# Altium project PCB_Project.PrjPcb (part 2 of 2)
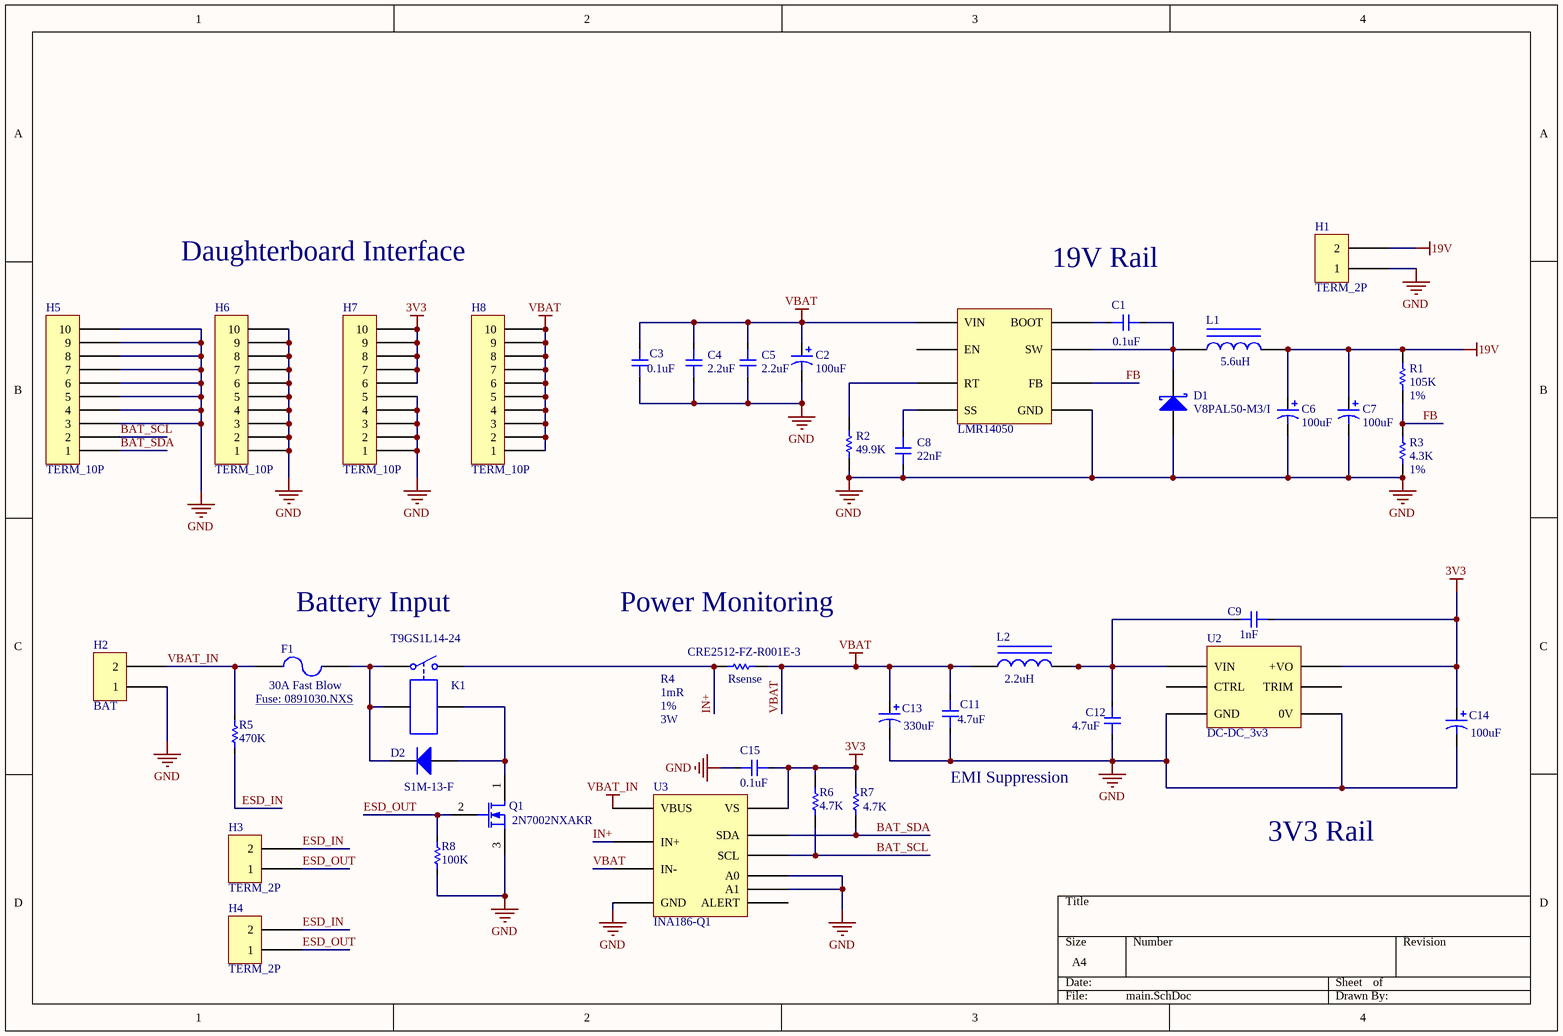
[diagram p1: main.SchDoc]

## Sheet main.SchDoc (continued)

### Library data of the parts
C1 = CAP 0805: Manufacturer: Yageo; Manufacturer Part Number: AC0805KRX7R8BB104; Voltage: 50V; Tolerance: 10%; Voltage Rating: 25V; Supplier 1: Digi-Key; Supplier Part Number 1: 311-3169-1-ND; Stock 1: 13795; Pricing 1: 1=0.23000, 10=0.15800, 100=0.08000, 500=0.05470, 1000=0.04840 (USD); RoHS: No; Mount: Surface Mount; Case/Package: 0805; Case Code (Imperial): 0805; Case Code (Metric): 2012; Min Operating Temperature: -55°C; Max Operating Temperature: 125°C; Packaging: Tape and Reel; Ratings: AEC-Q200; ComponentLink1URL: http://www.yageo.com/NewPortal/_en/search/productDocs.jsp?YageoPartNumber=AC0805KRX7R8BB104&src-supplier=Digi-Key; ComponentLink1Description: http://www.yageo.com/NewPortal/_en/search/productDocs.jsp?YageoPartNumber=AC0805KRX7R8BB104&src-supplier=Digi-Key
C2 = Cap Pol1: Polarized Capacitor (Radial); Manufacturer: Panasonic; Manufacturer Part Number: EEE-FTH101XAP; Tolerance: 20%; ESR (Equivalent Series Resistance): 340mR; Ripple Current: 350mA; Life (Hours): 2000Hour; Voltage: 50V; Leakage Current: 50uA; Lead Diameter: 0.65mm; Supplier 1: Digi-Key; Supplier Part Number 1: PCE5024CT-ND; Stock 1: 39470; Pricing 1: 1=0.76000, 10=0.56300, 100=0.38580 (USD); RoHS: Yes; Mount: Surface Mount,PCB; Case/Package: Radial; Number of Pins: 2; Contact Plating: Tin; Min Operating Temperature: -55°C; Max Operating Temperature: 105°C; Termination: SMD/SMT; Ripple Current (AC): 350mA; Packaging: Tape and Reel; Voltage Rating: 50V; Package Quantity: 1; Voltage Rating (DC): 50V; Diameter: 6.3mm; Length: 7.7mm; Height: 7.7mm; Height - Seated (Max): 0.315inch; Lead Pitch: 1.8mm; Radiation Hardening: No; REACH SVHC: No SVHC; ComponentLink1URL: https://datasheet.ciiva.com/11780/0900766b80f4973e-11780053.pdf?src-supplier=RSComponents; ComponentLink1Description: https://datasheet.ciiva.com/11780/0900766b80f4973e-11780053.pdf?src-supplier=RSComponents; ComponentLink2URL: https://datasheet.ciiva.com/28691/1244238-28691192.pdf?src-supplier=Element14; ComponentLink2Description: https://datasheet.ciiva.com/28691/1244238-28691192.pdf?src-supplier=Element14; ComponentLink3URL: https://datasheet.ciiva.com/6134/1790597-6134202.pdf?src-supplier=Farnell; ComponentLink3Description: https://datasheet.ciiva.com/6134/1790597-6134202.pdf?src-supplier=Farnell; ComponentLink4URL: https://datasheet.ciiva.com/46388/1790597-46388586.pdf?src-supplier=Element14; ComponentLink4Description: https://datasheet.ciiva.com/46388/1790597-46388586.pdf?src-supplier=Element14; ComponentLink5URL: https://datasheet.ciiva.com/10331/aba0000ce135-10331102.pdf?src-supplier=Avnet; ComponentLink5Description: https://datasheet.ciiva.com/10331/aba0000ce135-10331102.pdf?src-supplier=Avnet; ComponentLink6URL: https://datasheet.ciiva.com/17534/aba0000ce135-17534542.pdf?src-supplier=Avnet+Europe; ComponentLink6Description: https://datasheet.ciiva.com/17534/aba0000ce135-17534542.pdf?src-supplier=Avnet+Europe; ComponentLink7URL: https://datasheet.ciiva.com/43458/1790597-43458702.pdf?src-supplier=Farnell; ComponentLink7Description: https://datasheet.ciiva.com/43458/1790597-43458702.pdf?src-supplier=Farnell; ComponentLink8URL: https://datasheet.ciiva.com/46396/1790597-46396046.pdf?src-supplier=Element14; ComponentLink8Description: https://datasheet.ciiva.com/46396/1790597-46396046.pdf?src-supplier=Element14; ComponentLink9URL: https://datasheet.ciiva.com/11679/aba0000ce135-11679935.pdf?src-supplier=Avnet; ComponentLink9Description: https://datasheet.ciiva.com/11679/aba0000ce135-11679935.pdf?src-supplier=Avnet; ComponentLink10URL: https://datasheet.ciiva.com/48523/smd-ft-eng-tds-48523270.pdf?src-supplier=Distrelec; ComponentLink10Description: https://datasheet.ciiva.com/48523/smd-ft-eng-tds-48523270.pdf?src-supplier=Distrelec; ComponentLink11URL: https://datasheet.ciiva.com/24022/aba0000ce135-31031-24022620.pdf?src-supplier=Mouser; ComponentLink11Description: https://datasheet.ciiva.com/24022/aba0000ce135-31031-24022620.pdf?src-supplier=Mouser; ComponentLink12URL: https://datasheet.ciiva.com/28691/1244238-28691196.pdf?src-supplier=Element14; ComponentLink12Description: https://datasheet.ciiva.com/28691/1244238-28691196.pdf?src-supplier=Element14; ComponentLink13URL: https://datasheet.ciiva.com/16226/aba0000ce135-16226142.pdf?src-supplier=Future+Electronics; ComponentLink13Description: https://datasheet.ciiva.com/16226/aba0000ce135-16226142.pdf?src-supplier=Future+Electronics
C3 = CAP 0805: Manufacturer: TDK; Manufacturer Part Number: CGA5L2C0G1H104J160AA; Tolerance: 5%; Voltage Rating: 50V; Dielectric: C0G; Supplier 1: Digi-Key; Supplier Part Number 1: 445-6984-1-ND; Stock 1: 311401; Pricing 1: 1=0.56000, 10=0.39600, 100=0.26080, 500=0.19320, 1000=0.16422 (USD); RoHS: Yes; Mount: Surface Mount; Case/Package: 1206; Weight: 0.000571oz; Case Code (Metric): 3216; Case Code (Imperial): 1206; Min Operating Temperature: -55°C; Max Operating Temperature: 125°C; Packaging: Tape and Reel; Voltage Rating (DC): 50V; Termination: SMD/SMT; Package Quantity: 1; Composition: Ceramic; Length: 3.2mm; Height: 1.6mm; Depth: 1.6mm; Width: 0.063inch; Thickness: 0.075inch; Ratings: AEC-Q200; Lead Free: Lead Free; REACH SVHC: No SVHC; ComponentLink1URL: https://datasheet.ciiva.com/24216/cga5l2c0g1h104j160aa-266057-24216462.pdf?src-supplier=Mouser; ComponentLink1Description: https://datasheet.ciiva.com/24216/cga5l2c0g1h104j160aa-266057-24216462.pdf?src-supplier=Mouser; ComponentLink2URL: https://datasheet.ciiva.com/8079/1851769-8079783.pdf?src-supplier=Element14; ComponentLink2Description: https://datasheet.ciiva.com/8079/1851769-8079783.pdf?src-supplier=Element14; ComponentLink3URL: https://datasheet.ciiva.com/16428/mlcc-automotive-general-en-16428522.pdf?src-supplier=Future+Electronics; ComponentLink3Description: https://datasheet.ciiva.com/16428/mlcc-automotive-general-en-16428522.pdf?src-supplier=Future+Electronics; ComponentLink4URL: https://datasheet.ciiva.com/22725/1735392-22725659.pdf?src-supplier=Element14; ComponentLink4Description: https://datasheet.ciiva.com/22725/1735392-22725659.pdf?src-supplier=Element14; ComponentLink5URL: https://datasheet.ciiva.com/23803/1936565-23803102.pdf?src-supplier=Newark; ComponentLink5Description: https://datasheet.ciiva.com/23803/1936565-23803102.pdf?src-supplier=Newark; ComponentLink6URL: https://datasheet.ciiva.com/28620/1735392-28620703.pdf?src-supplier=Element14; ComponentLink6Description: https://datasheet.ciiva.com/28620/1735392-28620703.pdf?src-supplier=Element14
C4 C5 = CAP 0805: Manufacturer: Yageo; Manufacturer Part Number: AC0805KRX7R8BB223; Dielectric Material: Ceramic; Tolerance: 10%; Voltage Rating: 100V; Dielectric: X7R; Supplier 1: Digi-Key; Supplier Part Number 1: 311-3170-1-ND; Stock 1: 1274; Pricing 1: 1=0.24000, 10=0.16300, 100=0.08260, 500=0.05654, 1000=0.05001 (USD); RoHS: No; Supplier 2: Digi-Key; Supplier Part Number 2: 399-13375-1-ND; Stock 2: 10999; Pricing 2: 1=0.67000, 10=0.49700, 100=0.34050, 500=0.26958, 1000=0.22702 (USD); Mount: Surface Mount; Case/Package: 1210; Case Code (Imperial): 1210; Case Code (Metric): 3225; Min Operating Temperature: -55°C; Max Operating Temperature: 125°C; Packaging: Cut Tape; Capacitance: 2.2uF; Voltage Rating (DC): 100V; Length: 0.126inch; Width: 0.098inch; Ratings: AEC-Q200; REACH SVHC: No SVHC; ComponentLink1URL: http://www.farnell.com/datasheets/2746201.pdf?src-supplier=Farnell; ComponentLink1Description: http://www.farnell.com/datasheets/2746201.pdf?src-supplier=Farnell; ComponentLink2URL: http://www.farnell.com/datasheets/2746201.pdf?src-supplier=Element14; ComponentLink2Description: http://www.farnell.com/datasheets/2746201.pdf?src-supplier=Element14; ComponentLink3URL: https://api.kemet.com/component-edge/download/datasheet/C1210C225K1RACAUTO.pdf?src-supplier=Digi-Key; ComponentLink3Description: https://api.kemet.com/component-edge/download/datasheet/C1210C225K1RACAUTO.pdf?src-supplier=Digi-Key; ComponentLink4URL: http://www.farnell.com/datasheets/2746201.pdf?src-supplier=Newark; ComponentLink4Description: http://www.farnell.com/datasheets/2746201.pdf?src-supplier=Newark
C6 C7 = Cap Pol1: Polarized Capacitor (Radial); Manufacturer: Panasonic; Manufacturer Part Number: EEH-AZF1H101; Tolerance: 20%; Voltage Rating: 50V; ESR (Equivalent Series Resistance): 28mR; Life (Hours): 1000Hour; Supplier 1: Digi-Key; Supplier Part Number 1: P123935-ND; Stock 1: 1779; Pricing 1: 1=1.86000, 10=1.47200, 100=1.10360, 500=0.83386, 1000=0.73575, 2500=0.68670, 5000=0.66708 (USD); RoHS: No; Mount: Through Hole; Case/Package: Radial; Min Operating Temperature: -55°C; Max Operating Temperature: 150°C; Composition: Hybrid; Packaging: Bulk; Ratings: AEC-Q200; ComponentLink1URL: https://industrial.panasonic.com/cdbs/www-data/pdf/RDD0000/RDD0000C1240.pdf?src-supplier=Digi-Key; ComponentLink1Description: https://industrial.panasonic.com/cdbs/www-data/pdf/RDD0000/RDD0000C1240.pdf?src-supplier=Digi-Key
C8 = CAP 0805: Manufacturer: Yageo; Manufacturer Part Number: AC0805KRX7R8BB223; Voltage: 25V; Supplier 1: Digi-Key; Supplier Part Number 1: 311-3170-1-ND; Stock 1: 1274; Pricing 1: 1=0.24000, 10=0.16300, 100=0.08260, 500=0.05654, 1000=0.05001 (USD); RoHS: No
C9 = CAP 0805: Manufacturer: KEMET; Manufacturer Part Number: C0805C102K5RACAUTO; Voltage: 2kV; Dielectric Material: Ceramic; Tolerance: 10%; Dielectric: X7R; Voltage Rating: 50V; Supplier 1: Digi-Key; Supplier Part Number 1: 399-6921-1-ND; Stock 1: 6163; Pricing 1: 1=0.18000, 10=0.12200, 100=0.06200, 500=0.04240, 1000=0.03750 (USD); RoHS: Yes; Mount: Surface Mount; Case/Package: 0805; Case Code (Metric): 2012; Case Code (Imperial): 0805; Contact Plating: Tin,Matte; Min Operating Temperature: -55°C; Max Operating Temperature: 125°C; Capacitance: 1nF; Packaging: Tape and Reel; Package Quantity: 1; Voltage Rating (DC): 50V; Termination: SMD/SMT; Length: 2mm; Height: 0.78mm; Depth: 1.25mm; Width: 0.049inch; Thickness: 0.035inch; Ratings: AEC-Q200; Radiation Hardening: No; REACH SVHC: No SVHC; ComponentLink1URL: http://components.arrow.com/part/dataview/48355954S9860408N7429?src-supplier=Arrow; ComponentLink1Description: http://components.arrow.com/part/dataview/48355954S9860408N7429?src-supplier=Arrow; ComponentLink2URL: http://www.farnell.com/datasheets/2740239.pdf?src-supplier=Farnell; ComponentLink2Description: http://www.farnell.com/datasheets/2740239.pdf?src-supplier=Farnell; ComponentLink3URL: http://www.mouser.com/ds/2/212/KEM_C1023_X7R_AUTO_SMD-1093309.pdf?src-supplier=Mouser; ComponentLink3Description: http://www.mouser.com/ds/2/212/KEM_C1023_X7R_AUTO_SMD-1093309.pdf?src-supplier=Mouser; ComponentLink4URL: http://components.arrow.com/part/dataview/0323_00324849?src-supplier=Arrow+Europe; ComponentLink4Description: http://components.arrow.com/part/dataview/0323_00324849?src-supplier=Arrow+Europe; ComponentLink5URL: https://api.kemet.com/component-edge/download/datasheet/C0805C102K5RACAUTO.pdf?src-supplier=Digi-Key; ComponentLink5Description: https://api.kemet.com/component-edge/download/datasheet/C0805C102K5RACAUTO.pdf?src-supplier=Digi-Key; ComponentLink6URL: http://www.farnell.com/datasheets/1693454.pdf?src-supplier=Element14; ComponentLink6Description: http://www.farnell.com/datasheets/1693454.pdf?src-supplier=Element14; ComponentLink7URL: http://capacitoredge.kemet.com/capedge2/DataSheet?pn=C0805C102K5RACAUTO&src-supplier=Avnet; ComponentLink7Description: http://capacitoredge.kemet.com/capedge2/DataSheet?pn=C0805C102K5RACAUTO&src-supplier=Avnet; ComponentLink8URL: http://capacitoredge.kemet.com/capedge2/DataSheet?pn=C0805C102K5RACAUTO&src-supplier=Avnet+Europe; ComponentLink8Description: http://capacitoredge.kemet.com/capedge2/DataSheet?pn=C0805C102K5RACAUTO&src-supplier=Avnet+Europe; ComponentLink9URL: http://capacitoredge.kemet.com/capedge2/DataSheet/Datasheet-C0805C102K5RACAUTO.pdf?pn=C0805C102K5RACAUTO&src-supplier=Avnet+Asia; ComponentLink9Description: http://capacitoredge.kemet.com/capedge2/DataSheet/Datasheet-C0805C102K5RACAUTO.pdf?pn=C0805C102K5RACAUTO&src-supplier=Avnet+Asia; ComponentLink10URL: https://www.verical.com/server-webapp/html/getDatasheet?partID=385641&src-supplier=Verical; ComponentLink10Description: https://www.verical.com/server-webapp/html/getDatasheet?partID=385641&src-supplier=Verical
C11 C12 = CAP 0805: Manufacturer: KEMET; Manufacturer Part Number: C1206C475K5RACAUTO; Voltage: 50V; Supplier 1: Digi-Key; Supplier Part Number 1: 399-C1206C475K5RACAUTOCT-ND; Stock 1: 14194; Pricing 1: 1=0.47000, 10=0.32900, 100=0.19740, 500=0.14808, 1000=0.12505 (USD); ComponentLink1URL: http://www.farnell.com/datasheets/2818560.pdf?src-supplier=Newark; ComponentLink1Description: http://www.farnell.com/datasheets/2818560.pdf?src-supplier=Newark
  C12: RoHS: No
C13 = Cap Pol1: Polarized Capacitor (Radial); Manufacturer: Panasonic; Manufacturer Part Number: EEVFK1H331Q; Dielectric Material: Aluminium; Tolerance: 20%; Ripple Current: 900mA; Life (Hours): 5000Hour; Leakage Current: 3uA; Voltage: 50V; ESR (Equivalent Series Resistance): 120mR; Supplier 1: Digi-Key; Supplier Part Number 1: PCE3475CT-ND; Stock 1: 21014; Pricing 1: 1=1.25000, 10=0.98900, 100=0.74180 (USD); RoHS: Yes; Mount: Surface Mount,PCB; Case/Package: Radial; Number of Pins: 2; Contact Plating: Tin; Material: Aluminium; Min Operating Temperature: -55°C; Max Operating Temperature: 105°C; Termination: SMD/SMT; Packaging: Tape and Reel; Voltage Rating: 50V; Ripple Current (AC): 900mA; Voltage Rating (DC): 50V; Package Quantity: 1; Impedance: 120mR; Diameter: 12.5mm; Length: 14mm; Height: 13.5mm; Width: 900um; Height - Seated (Max): 0.531inch; Radiation Hardening: No; REACH SVHC: No SVHC; Lead Free: Lead Free; ComponentLink2URL: https://datasheet.ciiva.com/19479/2014086-19479334.pdf?src-supplier=Jameco; ComponentLink2Description: https://datasheet.ciiva.com/19479/2014086-19479334.pdf?src-supplier=Jameco; ComponentLink3URL: https://datasheet.ciiva.com/11780/0900766b80e4e8b0-11780888.pdf?src-supplier=RSComponents; ComponentLink3Description: https://datasheet.ciiva.com/11780/0900766b80e4e8b0-11780888.pdf?src-supplier=RSComponents; ComponentLink4URL: https://datasheet.ciiva.com/29313/443497-da-01-en-smd-elko-vfk-h13-330-uf-50v-29313613.pdf?src-supplier=Conrad; ComponentLink4Description: https://datasheet.ciiva.com/29313/443497-da-01-en-smd-elko-vfk-h13-330-uf-50v-29313613.pdf?src-supplier=Conrad; ComponentLink5URL: https://datasheet.ciiva.com/2984/aba0000ce120-2984084.pdf?src-supplier=Avnet; ComponentLink5Description: https://datasheet.ciiva.com/2984/aba0000ce120-2984084.pdf?src-supplier=Avnet; ComponentLink6URL: https://datasheet.ciiva.com/6019/1676921-6019142.pdf?src-supplier=Farnell; ComponentLink6Description: https://datasheet.ciiva.com/6019/1676921-6019142.pdf?src-supplier=Farnell; ComponentLink7URL: https://datasheet.ciiva.com/14607/70258115-14607832.pdf?src-supplier=Allied+Electronics; ComponentLink7Description: https://datasheet.ciiva.com/14607/70258115-14607832.pdf?src-supplier=Allied+Electronics; ComponentLink8URL: https://datasheet.ciiva.com/14605/70068597-14605945.pdf?src-supplier=Allied+Electronics; ComponentLink8Description: https://datasheet.ciiva.com/14605/70068597-14605945.pdf?src-supplier=Allied+Electronics; ComponentLink9URL: https://datasheet.ciiva.com/43485/1676921-43485516.pdf?src-supplier=Farnell; ComponentLink9Description: https://datasheet.ciiva.com/43485/1676921-43485516.pdf?src-supplier=Farnell; ComponentLink10URL: https://datasheet.ciiva.com/46390/1676921-46390108.pdf?src-supplier=Element14; ComponentLink10Description: https://datasheet.ciiva.com/46390/1676921-46390108.pdf?src-supplier=Element14; ComponentLink11URL: https://datasheet.ciiva.com/17533/aba0000ce120-17533557.pdf?src-supplier=Avnet+Europe; ComponentLink11Description: https://datasheet.ciiva.com/17533/aba0000ce120-17533557.pdf?src-supplier=Avnet+Europe; ComponentLink12URL: https://datasheet.ciiva.com/28691/1676921-28691493.pdf?src-supplier=Element14; ComponentLink12Description: https://datasheet.ciiva.com/28691/1676921-28691493.pdf?src-supplier=Element14
C14 = Cap Pol1: Polarized Capacitor (Radial); Manufacturer: Panasonic; Manufacturer Part Number: EEE-HC1C101XP; Dielectric Material: Aluminium; Tolerance: 20%; Ripple Current: 81mA; Life (Hours): 3000Hour; Voltage: 16V; Leakage Current: 3uA; Supplier 1: Digi-Key; Supplier Part Number 1: PCE3750CT-ND; Stock 1: 116749; Pricing 1: 1=0.12000 (USD); RoHS: Yes; Mount: Surface Mount,PCB; Case/Package: Radial; Number of Pins: 2; Contact Plating: Tin; Min Operating Temperature: -40°C; Max Operating Temperature: 105°C; Termination: SMD/SMT; Packaging: Tape and Reel; Voltage Rating: 16V; Package Quantity: 1; Voltage Rating (DC): 16V; Ripple Current (AC): 81mA; Diameter: 6.3mm; Length: 7.7mm; Height: 7.7mm; Height - Seated (Max): 0.303inch; Lead Pitch: 1.8mm; Width: 650um; Radiation Hardening: No; REACH SVHC: No SVHC; Lead Free: Lead Free; ComponentLink1URL: https://datasheet.ciiva.com/11783/0900766b80f32c51-11783687.pdf?src-supplier=RSComponents; ComponentLink1Description: https://datasheet.ciiva.com/11783/0900766b80f32c51-11783687.pdf?src-supplier=RSComponents; ComponentLink2URL: https://datasheet.ciiva.com/14600/70256859-14600870.pdf?src-supplier=Allied+Electronics; ComponentLink2Description: https://datasheet.ciiva.com/14600/70256859-14600870.pdf?src-supplier=Allied+Electronics; ComponentLink3URL: https://datasheet.ciiva.com/14599/70256859-14599241.pdf?src-supplier=Allied+Electronics; ComponentLink3Description: https://datasheet.ciiva.com/14599/70256859-14599241.pdf?src-supplier=Allied+Electronics; ComponentLink4URL: https://datasheet.ciiva.com/46376/370234-46376809.pdf?src-supplier=Element14; ComponentLink4Description: https://datasheet.ciiva.com/46376/370234-46376809.pdf?src-supplier=Element14; ComponentLink5URL: https://datasheet.ciiva.com/6134/370234-6134267.pdf?src-supplier=Farnell; ComponentLink5Description: https://datasheet.ciiva.com/6134/370234-6134267.pdf?src-supplier=Farnell; ComponentLink6URL: https://datasheet.ciiva.com/17535/aba0000ce109-17535947.pdf?src-supplier=Avnet+Europe; ComponentLink6Description: https://datasheet.ciiva.com/17535/aba0000ce109-17535947.pdf?src-supplier=Avnet+Europe; ComponentLink7URL: https://datasheet.ciiva.com/46386/370234-46386011.pdf?src-supplier=Element14; ComponentLink7Description: https://datasheet.ciiva.com/46386/370234-46386011.pdf?src-supplier=Element14; ComponentLink8URL: https://datasheet.ciiva.com/43455/370234-43455605.pdf?src-supplier=Farnell; ComponentLink8Description: https://datasheet.ciiva.com/43455/370234-43455605.pdf?src-supplier=Farnell; ComponentLink9URL: https://datasheet.ciiva.com/2985/aba0000ce109-2985932.pdf?src-supplier=Avnet; ComponentLink9Description: https://datasheet.ciiva.com/2985/aba0000ce109-2985932.pdf?src-supplier=Avnet; ComponentLink10URL: https://datasheet.ciiva.com/2985/aba0000ce109-2985933.pdf?src-supplier=Avnet; ComponentLink10Description: https://datasheet.ciiva.com/2985/aba0000ce109-2985933.pdf?src-supplier=Avnet
C15 = CAP 0805: CAP 0805 Decoupling; Manufacturer: KEMET; Manufacturer Part Number: C0805C104M5RACAUTO; Dielectric Material: Ceramic; Tolerance: 20%; Dielectric: X7R; Capacitance: 100nF; Voltage Rating: 50V; Supplier 1: Digi-Key; Supplier Part Number 1: 399-12977-1-ND; Stock 1: 17831; Pricing 1: 1=0.16000, 10=0.11500, 100=0.05410, 500=0.03794, 1000=0.03142 (USD); RoHS: Yes; Mount: Surface Mount; Case/Package: 0805; Case Code (Metric): 2012; Case Code (Imperial): 0805; Contact Plating: Tin,Matte; Min Operating Temperature: -55°C; Max Operating Temperature: 125°C; Packaging: Cut Tape; Voltage Rating (DC): 50V; Termination: Wraparound; Length: 2mm; Width: 0.049inch; Thickness: 0.035inch; Depth: 1.25mm; Ratings: AEC-Q200; REACH SVHC: No SVHC; ComponentLink1URL: http://components.arrow.com/part/dataview/0323_00324909?src-supplier=Arrow+Europe; ComponentLink1Description: http://components.arrow.com/part/dataview/0323_00324909?src-supplier=Arrow+Europe; ComponentLink2URL: http://www.farnell.com/datasheets/2741360.pdf?src-supplier=Farnell; ComponentLink2Description: http://www.farnell.com/datasheets/2741360.pdf?src-supplier=Farnell; ComponentLink3URL: http://components.arrow.com/part/dataview/42933023S8615449N7429?src-supplier=Arrow; ComponentLink3Description: http://components.arrow.com/part/dataview/42933023S8615449N7429?src-supplier=Arrow; ComponentLink4URL: http://capacitoredge.kemet.com/capedge2/DataSheet/Datasheet-C0805C104M5RACAUTO.pdf?pn=C0805C104M5RACAUTO&src-supplier=Avnet+Asia; ComponentLink4Description: http://capacitoredge.kemet.com/capedge2/DataSheet/Datasheet-C0805C104M5RACAUTO.pdf?pn=C0805C104M5RACAUTO&src-supplier=Avnet+Asia; ComponentLink5URL: http://www.farnell.com/datasheets/2741360.pdf?src-supplier=Newark; ComponentLink5Description: http://www.farnell.com/datasheets/2741360.pdf?src-supplier=Newark; ComponentLink6URL: https://api.kemet.com/component-edge/download/datasheet/C0805C104M5RACAUTO.pdf?src-supplier=Digi-Key; ComponentLink6Description: https://api.kemet.com/component-edge/download/datasheet/C0805C104M5RACAUTO.pdf?src-supplier=Digi-Key; ComponentLink7URL: http://www.farnell.com/datasheets/2741360.pdf?src-supplier=Element14; ComponentLink7Description: http://www.farnell.com/datasheets/2741360.pdf?src-supplier=Element14
D1 = D Schottky: Schottky Diode; Manufacturer: Vishay Semiconductors; Forward Voltage: 570mV; Max Reverse Voltage (DC): 50V; Element Configuration: Single; Average Rectified Current: 4A; Forward Current: 8A; Max Forward Surge Current (Ifsm): 120A; Peak Reverse Current: 40mA; PackageReference: SMB; PackageDescription: DO-214-AA/SMB; 2 C-Bend Leads; Body 5.3 x 3.6 mm, inc. leads (LxW); Code_JEDEC: DO-214-AA; Supplier 1: Digi-Key; Supplier Part Number 1: V8PAL50-M3/ICT-ND; Stock 1: 9149; Pricing 1: 1=0.87000, 10=0.76600, 25=0.72000, 100=0.52250, 250=0.50388, 500=0.43654, 1000=0.37152, 2500=0.34830, 5000=0.31347 (USD); RoHS: Yes; Mount: Surface Mount; Number of Pins: 2; Weight: 0.001129oz; Min Operating Temperature: -40°C; Max Operating Temperature: 150°C; Packaging: Tape and Reel; Package Quantity: 14000; Max Repetitive Reverse Voltage (Vrrm): 50V; Peak Non-Repetitive Surge Current: 120A; Length: 4.35mm; Height: 1mm; Width: 2.7mm; REACH SVHC: Unknown; ComponentLink1URL: https://datasheet.ciiva.com/29591/v8pal50-29591381.pdf?src-supplier=Digi-Key; ComponentLink1Description: https://datasheet.ciiva.com/29591/v8pal50-29591381.pdf?src-supplier=Digi-Key; ComponentLink2URL: https://datasheet.ciiva.com/29591/v8pal50-29591382.pdf?src-supplier=Digi-Key; ComponentLink2Description: https://datasheet.ciiva.com/29591/v8pal50-29591382.pdf?src-supplier=Digi-Key; ComponentLink3URL: https://datasheet.ciiva.com/29591/v8pal50-29591383.pdf?src-supplier=Digi-Key; ComponentLink3Description: https://datasheet.ciiva.com/29591/v8pal50-29591383.pdf?src-supplier=Digi-Key
D2 = Diode: Default Diode; Manufacturer: Diodes; Forward Current: 1A; Max Repetitive Reverse Voltage (Vrrm): 1kV; Reverse Recovery Time: 3us; Forward Voltage: 1.1V; Peak Reverse Current: 5uA; Peak Non-Repetitive Surge Current: 30A; Polarity: Standard; Capacitance: 10pF; Recovery Time: 1.8us; PackageVersion: Sep-1996; PackageReference: SMC; PackageDescription: DO-214-AB/SMC; 2 C-Bend Leads; Body 7.9 x 5.9 mm, inc. leads (LxW); Code_JEDEC: DO-214-AB; Supplier 1: Digi-Key; Supplier Part Number 1: S1M-FDICT-ND; Stock 1: 555751; Pricing 1: 1=0.24000, 10=0.19500, 25=0.16360, 100=0.08000, 250=0.07872, 500=0.06672, 1000=0.04636, 2500=0.04309 (USD); RoHS: Yes; Case/Package: SMA; Number of Pins: 2; Weight: 0.002258oz; Min Operating Temperature: -65°C; Max Operating Temperature: 150°C; Packaging: Tape and Reel; Max Forward Surge Current (Ifsm): 30A; Voltage Rating (DC): 1kV; Current Rating: 1A; Output Current: 1A; Package Quantity: 5000; Reverse Voltage (DC): 1kV; Average Rectified Current: 1A; Max Reverse Voltage (DC): 1kV; Termination: SMD/SMT; Length: 4.6mm; Height: 2.1mm; Width: 2.92mm; Radiation Hardening: No; REACH SVHC: No SVHC; Lead Free: Lead Free; ComponentLink2URL: https://datasheet.ciiva.com/22695/1911706-22695834.pdf?src-supplier=Element14; ComponentLink2Description: https://datasheet.ciiva.com/22695/1911706-22695834.pdf?src-supplier=Element14
F1 = Fuse 2: Fuse; Manufacturer: Keystone Electronics; Manufacturer Part Number: 3557-10; Number of Circuits: 1; ComponentLink1URL: http://www.keyelco.com/product-pdf.cfm?p=14226&src-supplier=Digi-Key; ComponentLink1Description: http://www.keyelco.com/product-pdf.cfm?p=14226&src-supplier=Digi-Key; Supplier 1: Digi-Key; Supplier Part Number 1: 36-3557-10-ND; Stock 1: 2058; Pricing 1: 1=1.03000, 25=0.85120, 100=0.80890, 250=0.77320, 500=0.71370, 1000=0.63520, 2500=0.53190, 5000=0.51110, 10000=0.47380 (USD); RoHS: No; Mount: PCB; Contact Material: Brass; Contact Plating: Tin; Current Rating: 30A; Orientation: Vertical; Termination: PC Pin; ComponentLink2URL: http://www.keyelco.com/product-pdf.cfm?p=14224&src-supplier=Digi-Key; ComponentLink2Description: http://www.keyelco.com/product-pdf.cfm?p=14224&src-supplier=Digi-Key
H1 H3 H4 = TERM_2P: Manufacturer: Molex; Manufacturer Part Number: 43650-0227; Connector Type: Header,Male Pin; Number of Positions: 2; Number of Ports: 1; Pitch: 3mm; Supplier 1: Digi-Key; Supplier Part Number 1: WM10656-ND; Stock 1: 3873; Pricing 1: 1=0.80000, 10=0.74800, 100=0.57340, 500=0.49860, 1000=0.41135, 5000=0.36149, 10000=0.33656 (USD); RoHS: Yes; Mount: Through Hole; Contact Plating: Tin,Bright; Color: Black; Contact Material: Brass; Housing Material: Thermoplastic; Number of Terminals: 2; Contact Shape: Square; Insulation Material: Polymer; Min Operating Temperature: -40°C; Max Operating Temperature: 105°C; Packaging: Tray; Package Quantity: 3264; Number of Rows: 1; Termination: Solder; Fastening Type: Ramp; Number of Contacts: 2; Orientation: Straight; Length: 9.65mm; Depth: 5.57mm; ComponentLink1URL: https://datasheet.ciiva.com/6840/436500227-sd-6840390.pdf?src-supplier=Digi-Key; ComponentLink1Description: https://datasheet.ciiva.com/6840/436500227-sd-6840390.pdf?src-supplier=Digi-Key; ComponentLink2URL: https://datasheet.ciiva.com/3944/28290436500227-pcb-headers-3944690.pdf?src-supplier=Arrow; ComponentLink2Description: https://datasheet.ciiva.com/3944/28290436500227-pcb-headers-3944690.pdf?src-supplier=Arrow; ComponentLink3URL: https://datasheet.ciiva.com/30077/0436500227-pcb-headers-30077244.pdf?src-supplier=Onlinecomponents.com; ComponentLink3Description: https://datasheet.ciiva.com/30077/0436500227-pcb-headers-30077244.pdf?src-supplier=Onlinecomponents.com; ComponentLink4URL: https://datasheet.ciiva.com/7920/1629867-7920765.pdf?src-supplier=Element14; ComponentLink4Description: https://datasheet.ciiva.com/7920/1629867-7920765.pdf?src-supplier=Element14
H2 = TERM_2P: Manufacturer: Anderson Power; Manufacturer Part Number: 1335G1, 1327G6-BK, 1327-BK; Gender: Female; Voltage Rating: 250V; Current Rating: 45A; Supplier 1: Digi-Key; Supplier Part Number 1: 2243-1335G1-ND; Stock 1: 2106; Pricing 1: 1=0.96000, 10=0.84200, 25=0.79200, 50=0.75900, 100=0.72600, 250=0.66000, 500=0.59400, 1000=0.52800, 2500=0.47850 (USD); RoHS: Yes; Mount: Through Hole; Contact Material: Copper,Copper Alloy; Contact Plating: Tin; Termination: Through Hole; REACH SVHC: No SVHC; ComponentLink1URL: https://datasheet.ciiva.com/18408/70162076-18408969.pdf?src-supplier=Allied+Electronics; ComponentLink1Description: https://datasheet.ciiva.com/18408/70162076-18408969.pdf?src-supplier=Allied+Electronics
K1 = Relay-SPST: Single-Pole Single-Throw Relay; Manufacturer: TE Connectivity P&B; Throw Configuration: SPST; Coil Voltage (DC): 24V; Contact Current Rating: 30A; Coil Type: Non-Latching; Operate Time: 15ms; Release Time: 22ms; Relay Type: General Purpose; Coil Current: 37.5mA; Coil Power: 900mW; Coil Resistance: 640R; Supplier 1: Digi-Key; Supplier Part Number 1: PB2395-ND; Stock 1: 2574; Pricing 1: 1=3.58000, 10=3.35300, 25=2.98000, 50=2.83100, 100=2.68200, 250=2.38400, 500=2.23500, 1000=2.08600, 5000=2.01150 (USD); RoHS: No; Mount: Through Hole; Contact Material: Tin,Silver; Min Operating Temperature: -40°C; Max Operating Temperature: 105°C; Termination: PC Pin; ComponentLink1URL: https://www.te.com/commerce/DocumentDelivery/DDEController?Action=srchrtrv&amp;DocNm=T9G_1216&amp;DocType=DS&amp;DocLang=English&src-supplier=Digi-Key; ComponentLink1Description: https://www.te.com/commerce/DocumentDelivery/DDEController?Action=srchrtrv&amp;DocNm=T9G_1216&amp;DocType=DS&amp;DocLang=English&src-supplier=Digi-Key
L1 = Inductor Iron: Magnetic-Core Inductor; Manufacturer: Bourns; Manufacturer Part Number: SRP7050TA-5R6M; Core Material: Carbonyl Powder; Tolerance: 20%; Current Rating: 6A; Saturation Current: 9A; Shielding: Shielded; DC Resistance (DCR): 49mR; Self Resonant Frequency: 20MHz; Test Frequency: 100kHz; Supplier 1: Digi-Key; Supplier Part Number 1: SRP7050TA-5R6MCT-ND; Stock 1: 2241; Pricing 1: 1=1.49000, 10=1.38300, 100=0.99990 (USD); RoHS: Yes; Mount: Surface Mount; Case/Package: Nonstandard; Min Operating Temperature: -40°C; Max Operating Temperature: 150°C; Inductance Tolerance: 20%; Packaging: Cut Tape; Composition: Wirewound; RMS Current (Irms): 6A; Length: 0.287inch; Width: 0.26inch; Height - Seated (Max): 0.197inch; Ratings: AEC-Q200; REACH SVHC: No SVHC; ComponentLink1URL: http://www.farnell.com/datasheets/2360569.pdf?src-supplier=Farnell; ComponentLink1Description: http://www.farnell.com/datasheets/2360569.pdf?src-supplier=Farnell; ComponentLink2URL: http://www.farnell.com/datasheets/1955472.pdf?src-supplier=Element14; ComponentLink2Description: http://www.farnell.com/datasheets/1955472.pdf?src-supplier=Element14; ComponentLink3URL: http://www.bourns.com/docs/Product-Datasheets/SRP7050TA.pdf?src-supplier=Digi-Key; ComponentLink3Description: http://www.bourns.com/docs/Product-Datasheets/SRP7050TA.pdf?src-supplier=Digi-Key; ComponentLink4URL: https://www.bourns.com/docs/Product-Datasheets/SRP7050TA.pdf?src-supplier=Digi-Key; ComponentLink4Description: https://www.bourns.com/docs/Product-Datasheets/SRP7050TA.pdf?src-supplier=Digi-Key
L2 = Inductor Iron: Magnetic-Core Inductor; Manufacturer: Bourns; Manufacturer Part Number: SRP4020TA-2R2M; Current: 4A; Core Material: Carbonyl Powder; Q Factor: 10; Inductance Tolerance: 20%; Saturation Current: 6A; Shielding: Shielded; DC Resistance (DCR): 61mR; Self Resonant Frequency: 45MHz; Test Frequency: 100kHz; Supplier 1: Digi-Key; Supplier Part Number 1: SRP4020TA-2R2MCT-ND; Stock 1: 310; Pricing 1: 1=1.42000, 10=1.32300, 100=0.95650, 500=0.73260, 1000=0.65120 (USD); RoHS: Yes; Mount: Surface Mount; Case/Package: SMD/SMT; Number of Pins: 2; Weight: 0.005291oz; Min Operating Temperature: -40°C; Max Operating Temperature: 150°C; Package Quantity: 3000; Packaging: Tape and Reel; Tolerance: 20%; Composition: Wirewound; Inductance: 2.2uH; Current Rating: 4A; RMS Current (Irms): 4A; Max DC Current: 4A; DC Current: 4A; Military Standard: Not; Termination: SMD/SMT; Length: 4.45mm; Height: 1.8mm; Width: 0.16inch; Height - Seated (Max): 0.079inch; Depth: 4.06mm; Ratings: AEC-Q200; REACH SVHC: No SVHC; ComponentLink1URL: https://media.digikey.com/pdf/Data%20Sheets/Bourns%20PDFs/SRP4012TA_SRP4020TA_Series_Bltn.pdf?src-supplier=Digi-Key; ComponentLink1Description: https://media.digikey.com/pdf/Data%20Sheets/Bourns%20PDFs/SRP4012TA_SRP4020TA_Series_Bltn.pdf?src-supplier=Digi-Key; ComponentLink2URL: http://www.farnell.com/datasheets/2059708.pdf?src-supplier=Farnell; ComponentLink2Description: http://www.farnell.com/datasheets/2059708.pdf?src-supplier=Farnell; ComponentLink3URL: http://www.mouser.com/ds/2/54/Bourns_SRP4020TA_datasheet-368577.pdf?src-supplier=Mouser; ComponentLink3Description: http://www.mouser.com/ds/2/54/Bourns_SRP4020TA_datasheet-368577.pdf?src-supplier=Mouser; ComponentLink4URL: http://www.alliedelec.com/images/products/datasheets/bm/BOURNS/70418816.pdf?src-supplier=Allied+Electronics; ComponentLink4Description: http://www.alliedelec.com/images/products/datasheets/bm/BOURNS/70418816.pdf?src-supplier=Allied+Electronics; ComponentLink5URL: http://www.farnell.com/datasheets/2059708.pdf?src-supplier=Element14; ComponentLink5Description: http://www.farnell.com/datasheets/2059708.pdf?src-supplier=Element14; ComponentLink6URL: http://components.arrow.com/part/dataview/67522511S1057632N9116?src-supplier=Arrow; ComponentLink6Description: http://components.arrow.com/part/dataview/67522511S1057632N9116?src-supplier=Arrow; ComponentLink7URL: http://www.bourns.com/data/global/pdfs/SRP4020TA.pdf?src-supplier=Avnet; ComponentLink7Description: http://www.bourns.com/data/global/pdfs/SRP4020TA.pdf?src-supplier=Avnet; ComponentLink8URL: http://www.farnell.com/datasheets/2059708.pdf?src-supplier=Newark; ComponentLink8Description: http://www.farnell.com/datasheets/2059708.pdf?src-supplier=Newark
Q1 = MOSFET-N: N-Channel MOSFET; Manufacturer: Nexperia; PackageVersion: 1995/1996; PackageReference: E3; PackageDescription: TO, Flat Index; 3 In-Line, Axial Leads; Body Dia. 4.6mm; Lead Dia. 0.5 mm (max); Supplier 1: Digi-Key; Supplier Part Number 1: 1727-8643-1-ND; Stock 1: 72619; Pricing 1: 1=0.10000, 10=0.07600, 25=0.07240, 100=0.03190, 250=0.03064, 500=0.02506, 1000=0.01740 (USD); RoHS: No
R1 = Res1: Resistor; Manufacturer: Vishay; Manufacturer Part Number: CRCW0603105KFKEA; Power Rating: 100mW; Temperature Coefficient: 100ppm/°C; Voltage Rating: 75V; Supplier 1: Digi-Key; Supplier Part Number 1: 541-105KHCT-ND; Stock 1: 2619; Pricing 1: 1=0.10000, 10=0.03400, 100=0.01390, 1000=0.00623, 2500=0.00540 (USD); RoHS: Yes; Case/Package: 0603; Number of Pins: 2; Weight: 7.1E-05oz; Case Code (Imperial): 0603; Case Code (Metric): 1608; Contact Plating: Tin; Min Operating Temperature: -55°C; Max Operating Temperature: 155°C; Packaging: Tape and Reel; Package Quantity: 10; Composition: Thick Film; Number of Terminations: 2; Termination: SMD/SMT; Max Power Dissipation: 100mW; Features: Automotive AEC-Q200; Military Standard: Not; Voltage Rating (DC): 75V; Working Voltage: 75V; Length: 1.55mm; Height: 0.02inch; Width: 0.85mm; Depth: 0.85mm; Radiation Hardening: No; Lead Free: Lead Free; REACH SVHC: Unknown; ComponentLink1URL: https://datasheet.ciiva.com/2466/dcrcwe3-2466299.pdf?src-supplier=Digi-Key; ComponentLink1Description: https://datasheet.ciiva.com/2466/dcrcwe3-2466299.pdf?src-supplier=Digi-Key; ComponentLink2URL: https://datasheet.ciiva.com/2466/dcrcwe3-2466300.pdf?src-supplier=Digi-Key; ComponentLink2Description: https://datasheet.ciiva.com/2466/dcrcwe3-2466300.pdf?src-supplier=Digi-Key; ComponentLink3URL: https://datasheet.ciiva.com/22708/1697337-22708060.pdf?src-supplier=Element14; ComponentLink3Description: https://datasheet.ciiva.com/22708/1697337-22708060.pdf?src-supplier=Element14; ComponentLink4URL: https://datasheet.ciiva.com/2466/dcrcwe3-2466301.pdf?src-supplier=Digi-Key; ComponentLink4Description: https://datasheet.ciiva.com/2466/dcrcwe3-2466301.pdf?src-supplier=Digi-Key; ComponentLink5URL: https://datasheet.ciiva.com/16784/70201119-16784633.pdf?src-supplier=Allied+Electronics; ComponentLink5Description: https://datasheet.ciiva.com/16784/70201119-16784633.pdf?src-supplier=Allied+Electronics; ComponentLink6URL: https://datasheet.ciiva.com/5546/dcrcwe3-109170-5546778.pdf?src-supplier=Mouser; ComponentLink6Description: https://datasheet.ciiva.com/5546/dcrcwe3-109170-5546778.pdf?src-supplier=Mouser; ComponentLink7URL: https://datasheet.ciiva.com/3256/dcrcwe3-3256935.pdf?src-supplier=Avnet; ComponentLink7Description: https://datasheet.ciiva.com/3256/dcrcwe3-3256935.pdf?src-supplier=Avnet
R2 = Res1: Resistor; Manufacturer: Vishay Dale; Manufacturer Part Number: CRCW060349K9FKEB; Resistance: 49.9kR; Tolerance: 1%; Power Rating: 100mW; Voltage Rating: 75V; Temperature Coefficient: 100ppm/°C; Supplier 1: Digi-Key; Supplier Part Number 1: 541-CRCW060349K9FKEBCT-ND; Stock 1: 19795; Pricing 1: 1=0.10000, 10=0.03400, 100=0.01390, 1000=0.00623, 2500=0.00540, 5000=0.00447 (USD); RoHS: Yes; Case/Package: 0603; Weight: 7.1E-05oz; Case Code (Imperial): 0603; Case Code (Metric): 1608; Contact Plating: Tin; Min Operating Temperature: -55°C; Max Operating Temperature: 155°C; Packaging: Tape and Reel; Package Quantity: 10000; Composition: Thick Film; Termination: SMD/SMT; Number of Terminations: 2; Military Standard: Not; Max Power Dissipation: 100mW; Voltage Rating (DC): 75V; Features: Automotive AEC-Q200; Length: 1.55mm; Height: 0.02inch; Width: 0.85mm; Depth: 0.85mm; Radiation Hardening: No; REACH SVHC: Unknown; Lead Free: Lead Free; ComponentLink1URL: https://datasheet.ciiva.com/26821/getdatasheetpartid-90990-26821125.pdf?src-supplier=Verical; ComponentLink1Description: https://datasheet.ciiva.com/26821/getdatasheetpartid-90990-26821125.pdf?src-supplier=Verical; ComponentLink2URL: https://datasheet.ciiva.com/9003/dcrcwe3-9003497.pdf?src-supplier=Avnet; ComponentLink2Description: https://datasheet.ciiva.com/9003/dcrcwe3-9003497.pdf?src-supplier=Avnet; ComponentLink3URL: https://datasheet.ciiva.com/7792/dcrcwe3-7792299.pdf?src-supplier=Element14; ComponentLink3Description: https://datasheet.ciiva.com/7792/dcrcwe3-7792299.pdf?src-supplier=Element14
R3 = Res1: Resistor; Manufacturer: Vishay; Manufacturer Part Number: CRCW06034K30FKEA; Temperature Coefficient: 100ppm/°C; Power Rating: 100mW; Voltage Rating: 75V; Supplier 1: Digi-Key; Supplier Part Number 1: 541-4.30KHCT-ND; Stock 1: 18560; Pricing 1: 1=0.10000, 10=0.03400, 100=0.01390, 1000=0.00623, 2500=0.00540 (USD); RoHS: Yes; Mount: Surface Mount; Case/Package: 0603; Number of Pins: 2; Weight: 7.1E-05oz; Contact Plating: Tin; Case Code (Metric): 1608; Case Code (Imperial): 0603; Min Operating Temperature: -55°C; Max Operating Temperature: 155°C; Composition: Thick Film; Packaging: Tape and Reel; Termination: SMD/SMT; Package Quantity: 10; Number of Terminations: 2; Max Power Dissipation: 100mW; Features: Automotive AEC-Q200; Military Standard: Not; Voltage Rating (DC): 75V; Length: 1.55mm; Height: 0.45mm; Width: 0.033inch; Depth: 0.85mm; Radiation Hardening: No; Lead Free: Lead Free; REACH SVHC: Unknown; ComponentLink1URL: https://datasheet.ciiva.com/11810/0900766b80d98afc-11810931.pdf?src-supplier=RSComponents; ComponentLink1Description: https://datasheet.ciiva.com/11810/0900766b80d98afc-11810931.pdf?src-supplier=RSComponents; ComponentLink2URL: https://datasheet.ciiva.com/2494/dcrcwe3-2494597.pdf?src-supplier=Digi-Key; ComponentLink2Description: https://datasheet.ciiva.com/2494/dcrcwe3-2494597.pdf?src-supplier=Digi-Key; ComponentLink3URL: https://datasheet.ciiva.com/9073/dcrcwe3-9073925.pdf?src-supplier=Avnet; ComponentLink3Description: https://datasheet.ciiva.com/9073/dcrcwe3-9073925.pdf?src-supplier=Avnet; ComponentLink4URL: https://datasheet.ciiva.com/16430/dcrcwe3-16430149.pdf?src-supplier=Future+Electronics; ComponentLink4Description: https://datasheet.ciiva.com/16430/dcrcwe3-16430149.pdf?src-supplier=Future+Electronics; ComponentLink5URL: https://datasheet.ciiva.com/2494/dcrcwe3-2494598.pdf?src-supplier=Digi-Key; ComponentLink5Description: https://datasheet.ciiva.com/2494/dcrcwe3-2494598.pdf?src-supplier=Digi-Key; ComponentLink6URL: https://datasheet.ciiva.com/16762/70201119-16762678.pdf?src-supplier=Allied+Electronics; ComponentLink6Description: https://datasheet.ciiva.com/16762/70201119-16762678.pdf?src-supplier=Allied+Electronics; ComponentLink7URL: https://datasheet.ciiva.com/22674/1700796-22674598.pdf?src-supplier=Element14; ComponentLink7Description: https://datasheet.ciiva.com/22674/1700796-22674598.pdf?src-supplier=Element14; ComponentLink8URL: https://datasheet.ciiva.com/22707/1697337-22707750.pdf?src-supplier=Element14; ComponentLink8Description: https://datasheet.ciiva.com/22707/1697337-22707750.pdf?src-supplier=Element14; ComponentLink9URL: https://datasheet.ciiva.com/2494/dcrcwe3-2494599.pdf?src-supplier=Digi-Key; ComponentLink9Description: https://datasheet.ciiva.com/2494/dcrcwe3-2494599.pdf?src-supplier=Digi-Key; ComponentLink10URL: https://datasheet.ciiva.com/5544/dcrcwe3-109170-5544359.pdf?src-supplier=Mouser; ComponentLink10Description: https://datasheet.ciiva.com/5544/dcrcwe3-109170-5544359.pdf?src-supplier=Mouser; ComponentLink11URL: https://datasheet.ciiva.com/22871/70201119-22871607.pdf?src-supplier=Allied+Electronics; ComponentLink11Description: https://datasheet.ciiva.com/22871/70201119-22871607.pdf?src-supplier=Allied+Electronics; ComponentLink12URL: https://datasheet.ciiva.com/7679/1697337-7679113.pdf?src-supplier=Element14; ComponentLink12Description: https://datasheet.ciiva.com/7679/1697337-7679113.pdf?src-supplier=Element14; ComponentLink13URL: https://datasheet.ciiva.com/3257/dcrcwe3-3257658.pdf?src-supplier=Avnet; ComponentLink13Description: https://datasheet.ciiva.com/3257/dcrcwe3-3257658.pdf?src-supplier=Avnet; ComponentLink14URL: https://datasheet.ciiva.com/7679/1697337-7679114.pdf?src-supplier=Element14; ComponentLink14Description: https://datasheet.ciiva.com/7679/1697337-7679114.pdf?src-supplier=Element14; ComponentLink15URL: https://datasheet.ciiva.com/26314/fld-crcw-e3-data-en-26314730.pdf?src-supplier=Distrelec; ComponentLink15Description: https://datasheet.ciiva.com/26314/fld-crcw-e3-data-en-26314730.pdf?src-supplier=Distrelec; ComponentLink16URL: https://datasheet.ciiva.com/7792/1700796-7792302.pdf?src-supplier=Element14; ComponentLink16Description: https://datasheet.ciiva.com/7792/1700796-7792302.pdf?src-supplier=Element14
R4 = Res1: Manufacturer: Bourns; Temperature Coefficient: 75ppm/°C; Supplier 1: Digi-Key; Supplier Part Number 1: CRE2512-FZ-R001E-3CT-ND; Stock 1: 17279; Pricing 1: 1=0.77000, 10=0.66800, 25=0.58680, 50=0.53640, 100=0.46550, 250=0.40480, 500=0.33598, 1000=0.27526 (USD); RoHS: Yes; Mount: Surface Mount; Case/Package: 2512; Case Code (Imperial): 2512; Case Code (Metric): 6432; Contact Plating: Tin; Min Operating Temperature: -55°C; Max Operating Temperature: 170°C; Composition: Metal Film,Thick Film,Metal Alloy; Number of Terminations: 2; Packaging: Cut Tape; Termination: Wraparound; Features: Moisture Resistant,Automotive AEC-Q200; Max Power Dissipation: 3W; Length: 6.45mm; Height: 0.035inch; Width: 0.132inch; Depth: 3.35mm; REACH SVHC: No SVHC; ComponentLink1URL: http://www.alliedelec.com/images/products/datasheets/bm/BOURNS/70418754.pdf?src-supplier=Allied+Electronics; ComponentLink1Description: http://www.alliedelec.com/images/products/datasheets/bm/BOURNS/70418754.pdf?src-supplier=Allied+Electronics; ComponentLink2URL: http://www.farnell.com/datasheets/2059712.pdf?src-supplier=Farnell; ComponentLink2Description: http://www.farnell.com/datasheets/2059712.pdf?src-supplier=Farnell; ComponentLink3URL: http://www.mouser.com/ds/2/54/Bourns_CRE_datasheet-369388.pdf?src-supplier=Mouser; ComponentLink3Description: http://www.mouser.com/ds/2/54/Bourns_CRE_datasheet-369388.pdf?src-supplier=Mouser; ComponentLink4URL: http://www.farnell.com/datasheets/1838634.pdf?src-supplier=Element14; ComponentLink4Description: http://www.farnell.com/datasheets/1838634.pdf?src-supplier=Element14; ComponentLink5URL: http://www.bourns.com/data/global/pdfs/CRE.pdf?src-supplier=Avnet; ComponentLink5Description: http://www.bourns.com/data/global/pdfs/CRE.pdf?src-supplier=Avnet; ComponentLink6URL: https://www.bourns.com/docs/technical-documents/featured-product-bulletins/Bourns_N1403_CRE_FPB.pdf?src-supplier=Digi-Key; ComponentLink6Description: https://www.bourns.com/docs/technical-documents/featured-product-bulletins/Bourns_N1403_CRE_FPB.pdf?src-supplier=Digi-Key; ComponentLink7URL: http://www.bourns.com/docs/Product-Datasheets/CRE.pdf?src-supplier=Digi-Key; ComponentLink7Description: http://www.bourns.com/docs/Product-Datasheets/CRE.pdf?src-supplier=Digi-Key
R5 = RES 0603: Manufacturer: TE Connectivity; Manufacturer Part Number: CRGCQ0603J470K; Supplier 1: Digi-Key; Supplier Part Number 1: A130107CT-ND; Stock 1: 79000; Pricing 1: 1=0.10000, 10=0.02100, 100=0.00860, 1000=0.00387, 2500=0.00336 (USD); RoHS: No; ComponentLink1URL: https://4donline.ihs.com/images/VipMasterIC/IC/TYEL/TYEL-S-A0004929575/TYEL-S-A0004929575-1.pdf?hkey=52A5661711E402568146F3353EA87419&src-supplier=Farnell; ComponentLink1Description: https://4donline.ihs.com/images/VipMasterIC/IC/TYEL/TYEL-S-A0004929575/TYEL-S-A0004929575-1.pdf?hkey=52A5661711E402568146F3353EA87419&src-supplier=Farnell; ComponentLink2URL: https://4donline.ihs.com/images/VipMasterIC/IC/TYEL/TYEL-S-A0004929575/TYEL-S-A0004929575-1.pdf?hkey=52A5661711E402568146F3353EA87419&src-supplier=Newark; ComponentLink2Description: https://4donline.ihs.com/images/VipMasterIC/IC/TYEL/TYEL-S-A0004929575/TYEL-S-A0004929575-1.pdf?hkey=52A5661711E402568146F3353EA87419&src-supplier=Newark
R6 R7 = Res1: Resistor; Manufacturer: TE Connectivity; Manufacturer Part Number: CRGH0603J4K7; Resistance: 4.7kR; Tolerance: 5%; Temperature Coefficient: 100ppm/°C; Voltage Rating (DC): 50V; Power Rating: 200mW; Number of Resistors: 1; Supplier 1: Digi-Key; Supplier Part Number 1: A126410CT-ND; Stock 1: 10284; Pricing 1: 1=0.10000, 10=0.04700, 100=0.01920, 1000=0.00861, 2500=0.00748 (USD); RoHS: Yes; Mount: Surface Mount; Case/Package: 0603; Case Code (Imperial): 0603; Case Code (Metric): 1608; Min Operating Temperature: -55°C; Max Operating Temperature: 125°C; Packaging: Tape and Reel; Number of Terminations: 2; Composition: Thick Film,Power resistor; Voltage Rating: 50V; Termination: Solder; Length: 1.6mm; Height: 0.45mm; Width: 0.8mm; Depth: 0.8mm; ELV: Compliant; REACH SVHC: No SVHC; ComponentLink1URL: https://datasheet.ciiva.com/28588/1755795-28588122.pdf?src-supplier=Element14; ComponentLink1Description: https://datasheet.ciiva.com/28588/1755795-28588122.pdf?src-supplier=Element14
R8 = RES 0603: Manufacturer: TE Connectivity; Manufacturer Part Number: CRGCQ0603J470K; Resistance: 100kR; Tolerance: 5%; Max Power Dissipation: 100mW; Temperature Coefficient: 100ppm/°C; Supplier 1: Digi-Key; Supplier Part Number 1: A130107CT-ND; Stock 1: 79000; Pricing 1: 1=0.10000, 10=0.02100, 100=0.00860, 1000=0.00387, 2500=0.00336 (USD); RoHS: No; ComponentLink1URL: https://4donline.ihs.com/images/VipMasterIC/IC/TYEL/TYEL-S-A0004929575/TYEL-S-A0004929575-1.pdf?hkey=52A5661711E402568146F3353EA87419&src-supplier=Farnell; ComponentLink1Description: https://4donline.ihs.com/images/VipMasterIC/IC/TYEL/TYEL-S-A0004929575/TYEL-S-A0004929575-1.pdf?hkey=52A5661711E402568146F3353EA87419&src-supplier=Farnell; ComponentLink2URL: https://4donline.ihs.com/images/VipMasterIC/IC/TYEL/TYEL-S-A0004929575/TYEL-S-A0004929575-1.pdf?hkey=52A5661711E402568146F3353EA87419&src-supplier=Newark; ComponentLink2Description: https://4donline.ihs.com/images/VipMasterIC/IC/TYEL/TYEL-S-A0004929575/TYEL-S-A0004929575-1.pdf?hkey=52A5661711E402568146F3353EA87419&src-supplier=Newark; Supplier 2: Digi-Key; Supplier Part Number 2: A130103CT-ND; Stock 2: 254563; Pricing 2: 1=0.10000, 10=0.02100, 100=0.00860, 1000=0.00387, 2500=0.00336 (USD); Case/Package: 0603; Case Code (Imperial): 0603; Case Code (Metric): 1608; Min Operating Temperature: -55°C; Max Operating Temperature: 155°C; Composition: Thick Film; Features: Moisture Resistant,Automotive AEC-Q200; Packaging: Tape and Reel; Number of Terminations: 2; ComponentLink3URL: https://www.te.com/commerce/DocumentDelivery/DDEController?Action=srchrtrv&amp;DocNm=1773204-3&amp;DocType=DS&amp;DocLang=English&src-supplier=Digi-Key; ComponentLink3Description: https://www.te.com/commerce/DocumentDelivery/DDEController?Action=srchrtrv&amp;DocNm=1773204-3&amp;DocType=DS&amp;DocLang=English&src-supplier=Digi-Key; ComponentLink4URL: https://4donline.ihs.com/images/VipMasterIC/IC/TYEL/TYEL-S-A0004929575/TYEL-S-A0004929575-1.pdf?hkey=52A5661711E402568146F3353EA87419&src-supplier=Element14; ComponentLink4Description: https://4donline.ihs.com/images/VipMasterIC/IC/TYEL/TYEL-S-A0004929575/TYEL-S-A0004929575-1.pdf?hkey=52A5661711E402568146F3353EA87419&src-supplier=Element14
U2 = DC-DC_3v3: Manufacturer: CUI; Manufacturer Part Number: PDQE15-Q24-S3-D; Supplier 1: Digi-Key; Supplier Part Number 1: 102-6252-ND; Stock 1: 37; Pricing 1: 1=19.13000, 5=18.98000, 10=18.83200, 25=18.53760, 50=17.65500, 100=16.18380, 250=15.88952, 500=15.65410 (USD); RoHS: No
U3 = INA233: High-Side or Low-Side Measurement, Bidirectional Current and Power Monitor